# EAGLE schematic coyoho-switch8 (EAGLE 5.10)

## Sheet 1 of 2
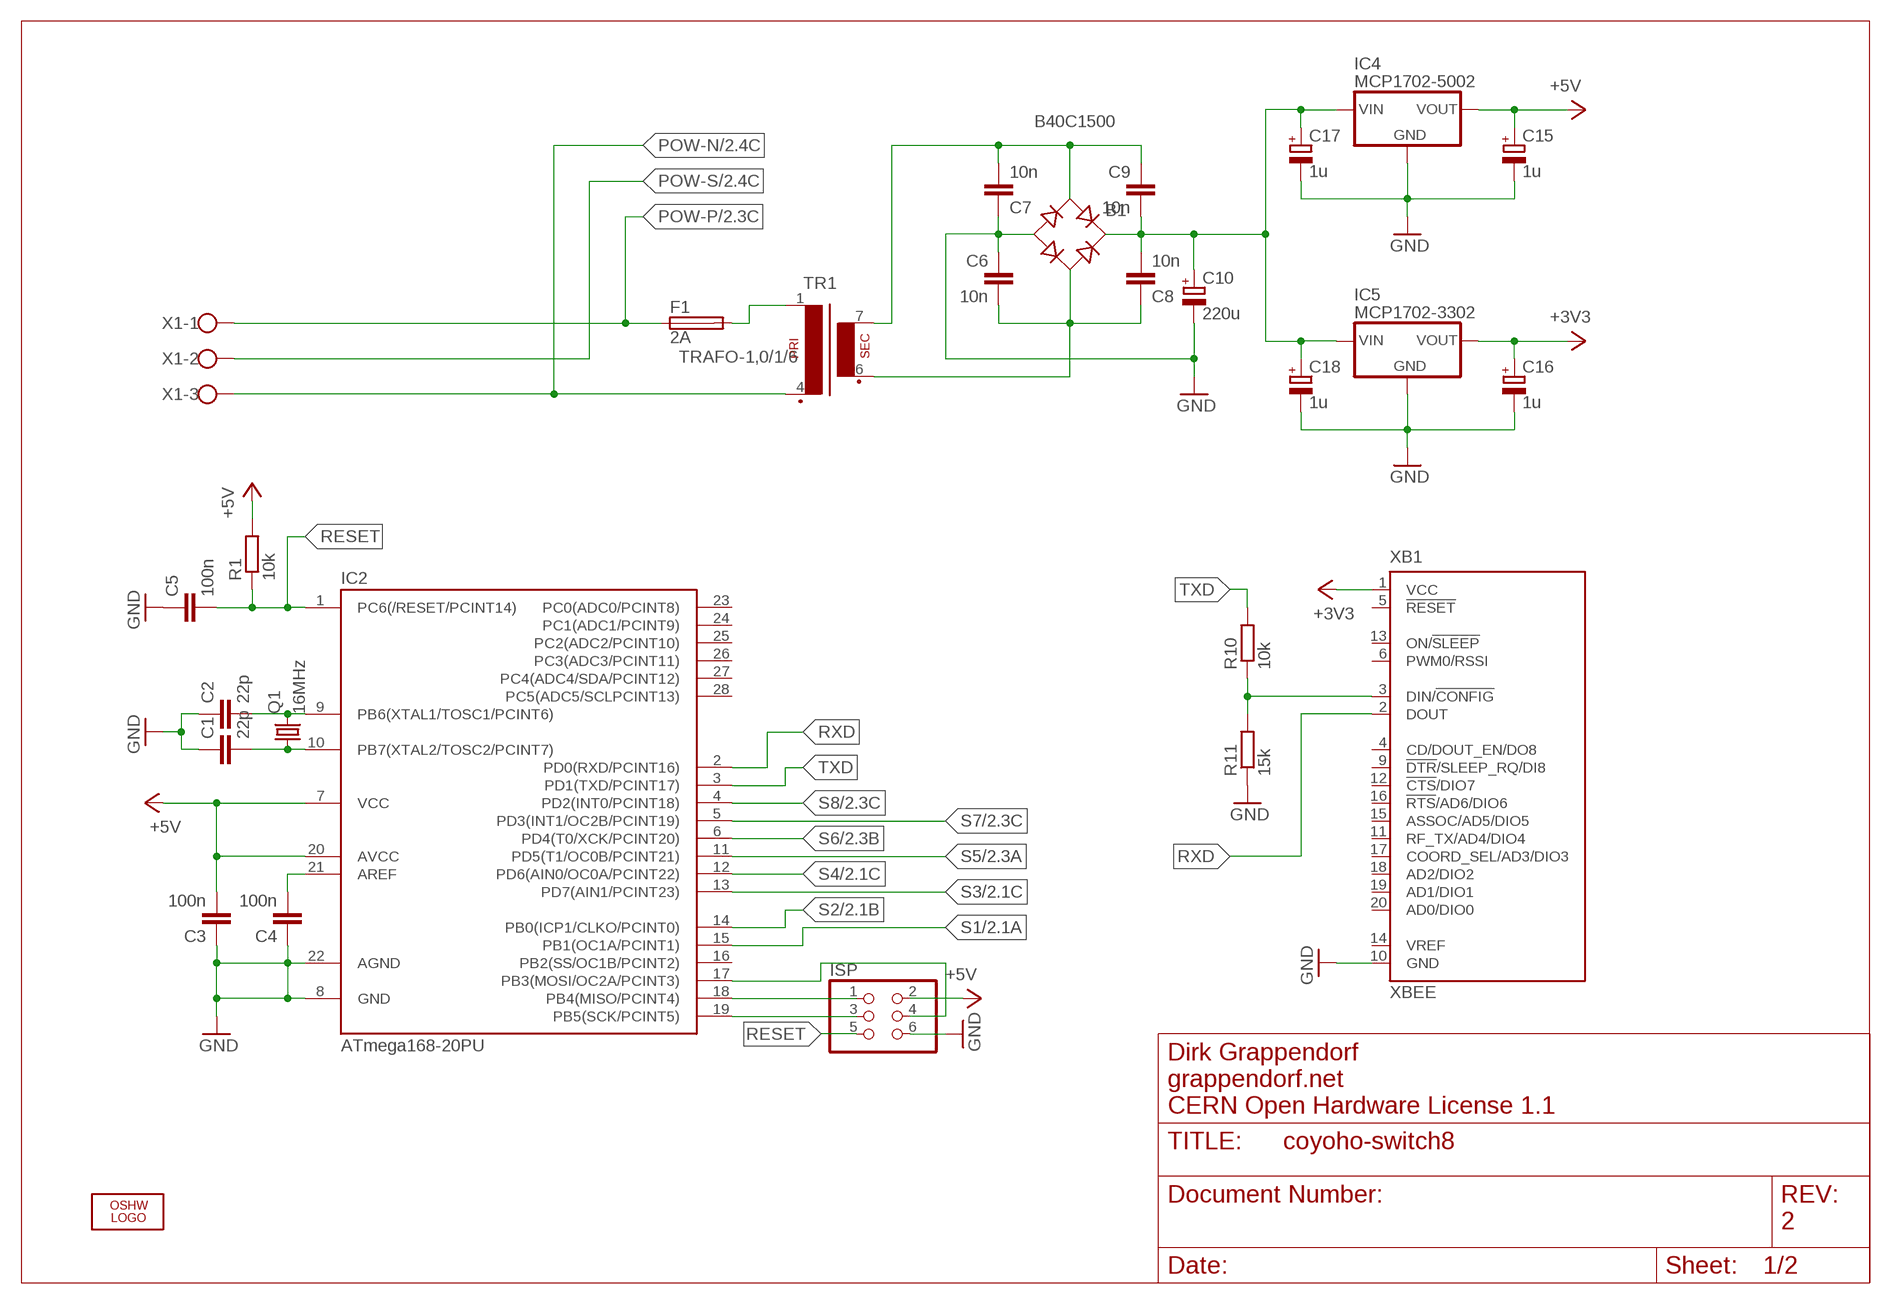
[diagram p0: schematic, sheet 1]

### Parts
B1  B40C1500  RECTIFIER-2KBB  [2KBB]
C1  22p  C-EU025-025X050  [C025-025X050]
C2  22p  C-EU025-025X050  [C025-025X050]
C3  100n  C-EU025-024X044  [C025-024X044]
C4  100n  C-EU025-024X044  [C025-024X044]
C5  100n  C-EU025-024X044  [C025-024X044]
C6  10n  C-EU025-024X044  [C025-024X044]
C7  10n  C-EU025-024X044  [C025-024X044]
C8  10n  C-EU025-024X044  [C025-024X044]
C9  10n  C-EU025-024X044  [C025-024X044]
C10  220u  CPOL-EUE3.5-8  [E3,5-8]
C15  1u  CPOL-EUE2.5-5  [E2,5-5]
C16  1u  CPOL-EUE2.5-5  [E2,5-5]
C17  1u  CPOL-EUE2.5-5  [E2,5-5]
C18  1u  CPOL-EUE2.5-5  [E2,5-5]
F1  2A  SH22,5  [SH22,5]
IC2  ATmega168-20PU  ATMEGA48/88/168-PU  [DIL28-3]
IC4  MCP1702-5002  MCP1702  [MCP1702]
IC5  MCP1702-3302  MCP1702  [MCP1702]
ISP  PINHD-2X3  [2X03]
LOGO1  OSHW_LOGO_10MILX0350-NT-BOTTOM  [OSHW_10X350_NOTEXT_BOTTOM]
Q1  16MHz  CRYSTALHC49U-V  [HC49U-V]
R1  10k  R-EU_0204/7  [0204/7]
R10  10k  R-EU_0204/7  [0204/7]
R11  15k  R-EU_0204/7  [0204/7]
TR1  TRAFO-1,0/1/6  [TRAFO-1,0/1/6]
X1  W237-103  [W237-103]
XB1  XBEE  [XBEE]

### Nets
+3V3: C16.+ IC5.VOUT(OUT) XB1.1(VCC)
+5V: C3.2 C15.+ IC2.7(VCC) IC2.20(AVCC) IC4.VOUT(OUT) ISP.2 R1.2
GND: B1.- C1.1 C2.1 C3.1 C4.1 C5.1 C6.1 C7.1 C10.- C15.- C16.- C17.- C18.- IC2.8(GND) IC2.22(AGND) IC4.GND IC5.GND ISP.6 R11.1 XB1.10(GND) ; also sheet 2
N$1: C2.2 IC2.9(PB6(XTAL1/TOSC1/PCINT6)) Q1.2
N$2: C1.2 IC2.10(PB7(XTAL2/TOSC2/PCINT7)) Q1.1
N$3: C4.2 IC2.21(AREF)
N$4: IC2.18(PB4(MISO/PCINT4)) ISP.1
N$6: IC2.19(PB5(SCK/PCINT5)) ISP.3
N$12: B1.AC1 C7.2 C9.1 TR1.7(S4)
N$14: B1.+ C8.2 C9.2 C10.+ C17.+ C18.+ IC4.VIN(IN) IC5.VIN(IN)
N$22: IC2.17(PB3(MOSI/OC2A/PCINT3)) ISP.4
N$42: F1.2 TR1.1
N$49: R10.1 R11.2 XB1.3(DIN/!CONFIG)
N$50: B1.AC2 C6.2 C8.1 TR1.6(S3)
POW-N: TR1.4(P2) X1.3 ; also sheet 2
POW-P: F1.1 X1.1 ; also sheet 2
POW-S: X1.2 ; also sheet 2
RESET: C5.2 IC2.1(PC6(/RESET/PCINT14)) ISP.5 R1.1
RXD: IC2.2(PD0(RXD/PCINT16)) XB1.2(DOUT)
S1: IC2.15(PB1(OC1A/PCINT1)) ; also sheet 2
S2: IC2.14(PB0(ICP1/CLKO/PCINT0)) ; also sheet 2
S3: IC2.13(PD7(AIN1/PCINT23)) ; also sheet 2
S4: IC2.12(PD6(AIN0/OC0A/PCINT22)) ; also sheet 2
S5: IC2.11(PD5(T1/OC0B/PCINT21)) ; also sheet 2
S6: IC2.6(PD4(T0/XCK/PCINT20)) ; also sheet 2
S7: IC2.5(PD3(INT1/OC2B/PCINT19)) ; also sheet 2
S8: IC2.4(PD2(INT0/PCINT18)) ; also sheet 2
TXD: IC2.3(PD1(TXD/PCINT17)) R10.2
Unconnected: IC2.16(PB2(SS/OC1B/PCINT2)) IC2.23(PC0(ADC0/PCINT8)) IC2.24(PC1(ADC1/PCINT9)) IC2.25(PC2(ADC2/PCINT10)) IC2.26(PC3(ADC3/PCINT11)) IC2.27(PC4(ADC4/SDA/PCINT12)) IC2.28(PC5(ADC5/SCLPCINT13)) XB1.4(CD/DOUT_EN/DO8) XB1.5(!RESET) XB1.6(PWM0/RSSI) XB1.9(!DTR!/SLEEP_RQ/DI8) XB1.11(RF_TX/AD4/DIO4) XB1.12(!CTS!/DIO7) XB1.13(ON/!SLEEP) XB1.14(VREF) XB1.15(ASSOC/AD5/DIO5) XB1.16(!RTS!/AD6/DIO6) XB1.17(COORD_SEL/AD3/DIO3) XB1.18(AD2/DIO2) XB1.19(AD1/DIO1) XB1.20(AD0/DIO0)

### Notes on the sheet
- Dirk Grappendorf
- grappendorf.net
- CERN Open Hardware License 1.1
- 2

## Sheet 2 of 2
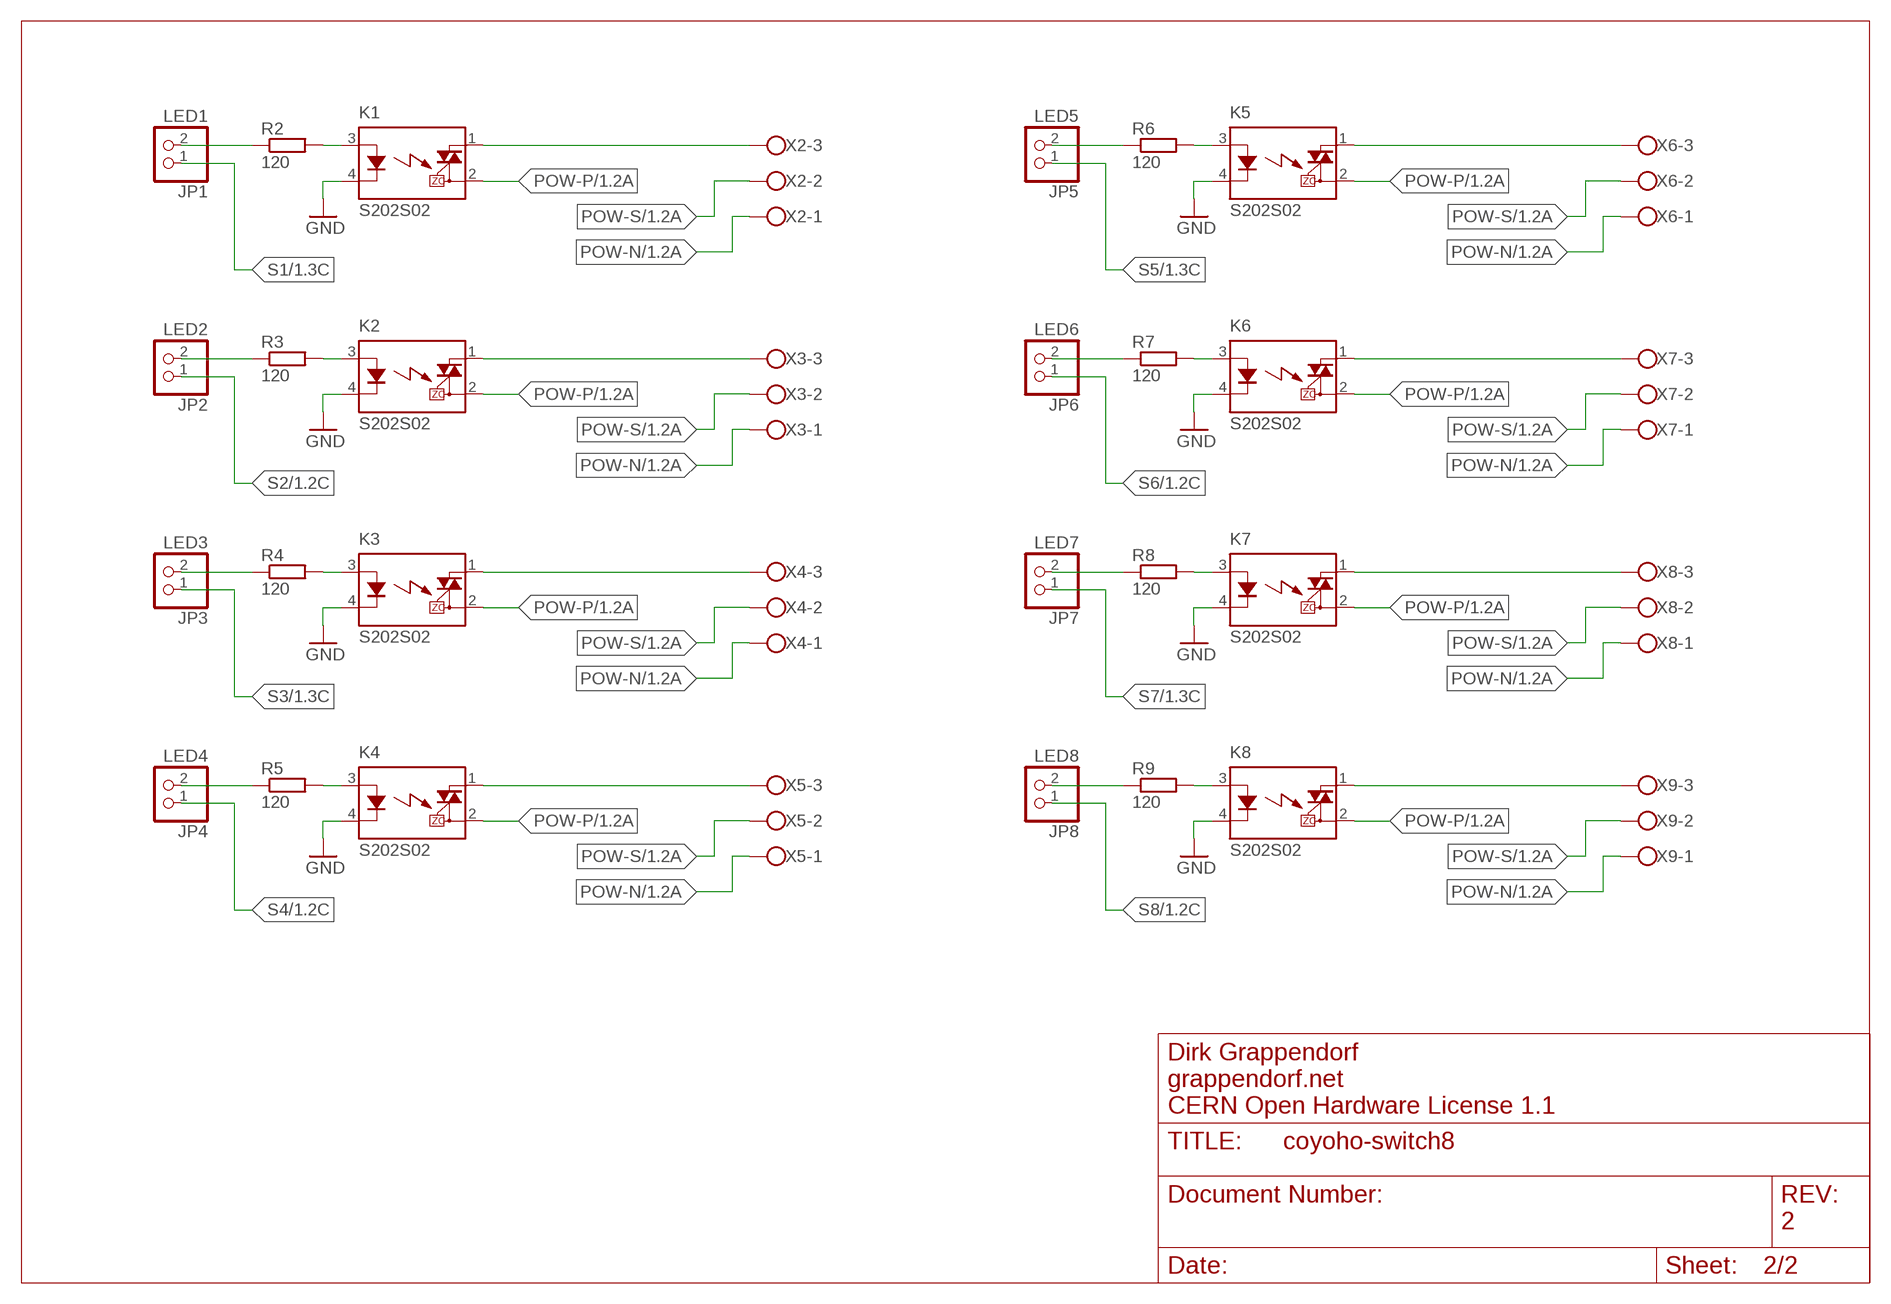
[diagram p1: schematic, sheet 2]

### Parts
JP1  LED1  PINHD-1X2  [1X02]
JP2  LED2  PINHD-1X2  [1X02]
JP3  LED3  PINHD-1X2  [1X02]
JP4  LED4  PINHD-1X2  [1X02]
JP5  LED5  PINHD-1X2  [1X02]
JP6  LED6  PINHD-1X2  [1X02]
JP7  LED7  PINHD-1X2  [1X02]
JP8  LED8  PINHD-1X2  [1X02]
K1  S202S02  [S202S02]
K2  S202S02  [S202S02]
K3  S202S02  [S202S02]
K4  S202S02  [S202S02]
K5  S202S02  [S202S02]
K6  S202S02  [S202S02]
K7  S202S02  [S202S02]
K8  S202S02  [S202S02]
R2  120  R-EU_0204/7  [0204/7]
R3  120  R-EU_0204/7  [0204/7]
R4  120  R-EU_0204/7  [0204/7]
R5  120  R-EU_0204/7  [0204/7]
R6  120  R-EU_0204/7  [0204/7]
R7  120  R-EU_0204/7  [0204/7]
R8  120  R-EU_0204/7  [0204/7]
R9  120  R-EU_0204/7  [0204/7]
X2  W237-103  [W237-103]
X3  W237-103  [W237-103]
X4  W237-103  [W237-103]
X5  W237-103  [W237-103]
X6  W237-103  [W237-103]
X7  W237-103  [W237-103]
X8  W237-103  [W237-103]
X9  W237-103  [W237-103]

### Nets
GND: K1.4(K) K2.4(K) K3.4(K) K4.4(K) K5.4(K) K6.4(K) K7.4(K) K8.4(K) ; also sheet 1
N$7: K1.1(DS1) X2.3
N$9: K2.1(DS1) X3.3
N$10: K3.1(DS1) X4.3
N$11: K4.1(DS1) X5.3
N$13: K5.1(DS1) X6.3
N$15: K6.1(DS1) X7.3
N$16: K7.1(DS1) X8.3
N$17: K8.1(DS1) X9.3
N$18: JP1.2 R2.1
N$19: K1.3(A) R2.2
N$20: JP2.2 R3.1
N$21: K2.3(A) R3.2
N$23: JP3.2 R4.1
N$24: K3.3(A) R4.2
N$29: JP4.2 R5.1
N$30: K4.3(A) R5.2
N$31: JP5.2 R6.1
N$32: K5.3(A) R6.2
N$33: JP6.2 R7.1
N$34: K6.3(A) R7.2
N$35: JP7.2 R8.1
N$36: K7.3(A) R8.2
N$37: JP8.2 R9.1
N$38: K8.3(A) R9.2
POW-N: X2.1 X3.1 X4.1 X5.1 X6.1 X7.1 X8.1 X9.1 ; also sheet 1
POW-P: K1.2(DS2) K2.2(DS2) K3.2(DS2) K4.2(DS2) K5.2(DS2) K6.2(DS2) K7.2(DS2) K8.2(DS2) ; also sheet 1
POW-S: X2.2 X3.2 X4.2 X5.2 X6.2 X7.2 X8.2 X9.2 ; also sheet 1
S1: JP1.1 ; also sheet 1
S2: JP2.1 ; also sheet 1
S3: JP3.1 ; also sheet 1
S4: JP4.1 ; also sheet 1
S5: JP5.1 ; also sheet 1
S6: JP6.1 ; also sheet 1
S7: JP7.1 ; also sheet 1
S8: JP8.1 ; also sheet 1

### Notes on the sheet
- Dirk Grappendorf
- grappendorf.net
- CERN Open Hardware License 1.1
- 2

## Library data of the parts
B1 = rectifier:RECTIFIER-: Rectifier
C1-C9 = rcl:C-EU: CAPACITOR, European symbol
C10 C15-C18 = rcl:CPOL-EU: POLARIZED CAPACITOR, European symbol
F1 = fuse:SH22,5: FUSE HOLDER grid 22,5 mm, OGN0031 8201, Schurter (Buerklin)
IC2 = atmega8:ATMEGA48/88/168-PU
IC4 IC5 = grapelabs:MCP1702: VOLTAGE REGULATOR
ISP = pinhead:PINHD-2X3: PIN HEADER
JP1-JP8 = pinhead:PINHD-1X2: PIN HEADER
K1-K8 = relay:S*02S02: IT(rms) 8A, Zero Cross type SIP 4pin Triac output SSR Source: http://sharp-world.com/products/device/lineup/data/pdf/datasheet/s102s02_e.pdf
LOGO1 = OSHW:OSHW_LOGO_10MIL
Q1 = crystal:CRYSTAL: CRYSTAL
R1-R11 = rcl:R-EU_: RESISTOR, European symbol
TR1 = grapelabs:TRAFO-1,0/1/6: TRANSFORMER 1 primary winding, 1 secondary winding BLOCK
X1-X9 = con-wago-500:W237-103: WAGO SCREW CLAMP
XB1 = maxstream:XBEE: XBee (TM) /XBee-PRO(TM) OEM RF Modules Source: MaxStream, Inc. xbee_productmanual.pdf